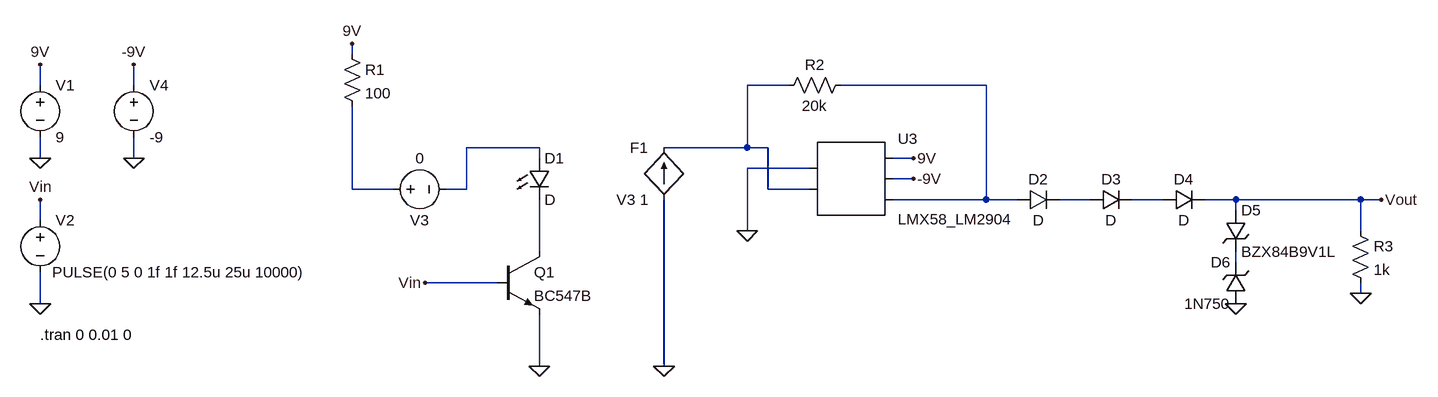
[diagram p0: schematic revolusys-communication.asc]
revolusys-communication.asc, the LTspice schematic file:
Version 4
SHEET 1 1832 680
WIRE 176 -272 176 -288
WIRE -304 -224 -304 -256
WIRE -160 -224 -160 -256
WIRE 848 -224 784 -224
WIRE 1152 -224 928 -224
WIRE 464 -128 352 -128
WIRE 784 -128 784 -224
WIRE 784 -128 656 -128
WIRE 816 -128 784 -128
WIRE -304 -112 -304 -144
WIRE -160 -112 -160 -144
WIRE 464 -112 464 -128
WIRE 1040 -112 1008 -112
WIRE 880 -96 784 -96
WIRE 1040 -80 1008 -80
WIRE 176 -64 176 -192
WIRE 240 -64 176 -64
WIRE 352 -64 352 -128
WIRE 352 -64 320 -64
WIRE 816 -64 816 -128
WIRE 880 -64 816 -64
WIRE 1152 -48 1152 -224
WIRE 1152 -48 1008 -48
WIRE 1200 -48 1152 -48
WIRE 1312 -48 1264 -48
WIRE 1424 -48 1376 -48
WIRE 1536 -48 1488 -48
WIRE 1728 -48 1536 -48
WIRE 1760 -48 1728 -48
WIRE 1536 -32 1536 -48
WIRE -304 -16 -304 -48
WIRE 784 0 784 -96
WIRE 1728 0 1728 -48
WIRE 464 32 464 -48
WIRE 1536 48 1536 32
WIRE 400 80 288 80
WIRE 1728 96 1728 80
WIRE -304 112 -304 64
WIRE 464 208 464 128
WIRE 656 208 656 -48
FLAG 464 208 0
FLAG -304 -112 0
FLAG -304 112 0
FLAG 656 208 0
FLAG 784 0 0
FLAG -304 -256 9V
FLAG 1040 -112 9V
FLAG 1728 96 0
FLAG -160 -112 0
FLAG 1536 112 0
FLAG -160 -256 -9V
FLAG 1040 -80 -9V
FLAG 176 -288 9V
FLAG -304 -48 Vin
FLAG 288 80 Vin
FLAG 1760 -48 Vout
SYMBOL npn 400 32 R0
SYMATTR InstName Q1
SYMATTR Value BC547B
SYMBOL res 160 -288 R0
SYMATTR InstName R1
SYMATTR Value 100
SYMBOL voltage -304 -240 R0
WINDOW 123 0 0 Left 2
WINDOW 39 0 0 Left 2
SYMATTR InstName V1
SYMATTR Value 9
SYMBOL voltage -304 -32 R0
WINDOW 123 0 0 Left 2
WINDOW 39 24 124 Left 2
WINDOW 3 18 96 Left 2
SYMATTR InstName V2
SYMATTR Value PULSE(0 5 0 1f 1f 12.5u 25u 10000)
SYMBOL res 944 -240 R90
WINDOW 0 0 56 VBottom 2
WINDOW 3 32 56 VTop 2
SYMATTR InstName R2
SYMATTR Value 20k
SYMBOL AutoGenerated\\LMX58_LM2904 944 -80 R0
SYMATTR InstName U3
SYMBOL LED 448 -112 R0
SYMATTR InstName D1
SYMBOL voltage 224 -64 R270
WINDOW 0 -32 56 VBottom 2
WINDOW 3 32 56 VTop 2
WINDOW 123 0 0 Left 2
WINDOW 39 0 0 Left 2
SYMATTR InstName V3
SYMATTR Value 0
SYMBOL f 656 -48 R180
WINDOW 0 24 80 Left 2
WINDOW 3 24 0 Left 2
SYMATTR InstName F1
SYMATTR Value V3 1
SYMBOL diode 1200 -32 R270
WINDOW 0 32 32 VTop 2
WINDOW 3 0 32 VBottom 2
SYMATTR InstName D2
SYMBOL diode 1312 -32 R270
WINDOW 0 32 32 VTop 2
WINDOW 3 0 32 VBottom 2
SYMATTR InstName D3
SYMBOL diode 1424 -32 R270
WINDOW 0 32 32 VTop 2
WINDOW 3 0 32 VBottom 2
SYMATTR InstName D4
SYMBOL res 1712 -16 R0
SYMATTR InstName R3
SYMATTR Value 1k
SYMBOL voltage -160 -240 R0
WINDOW 123 0 0 Left 2
WINDOW 39 0 0 Left 2
SYMATTR InstName V4
SYMATTR Value -9
SYMBOL zener 1520 -32 R0
SYMATTR InstName D5
SYMATTR Value BZX84B9V1L
SYMATTR Description Diode
SYMATTR Type diode
SYMBOL zener 1552 112 R180
WINDOW 0 24 64 Left 2
WINDOW 3 24 0 Left 2
SYMATTR InstName D6
SYMATTR Value 1N750
SYMATTR Description Diode
SYMATTR Type diode
TEXT -304 160 Left 2 !.tran 0 0.01 0

The netlist it stands for:
* revolusys-communication.asc
Q1 N007 Vin 0 0 BC547B
R1 9V N004 100
V1 9V 0 9
V2 Vin 0 PULSE(0 5 0 1f 1f 12.5u 25u 10000)
R2 N002 N001 20k
* U3: LMX58_LM2904 (symbol AutoGenerated\LMX58_LM2904 not available, pins judged from their places): pin1=0 pin2=N001 pin3=9V pin4=-9V pin5=N002
D1 N003 N007 D
V3 N004 N003 0
F1 0 N001 V3 1
D2 N002 N005 D
D3 N005 N006 D
D4 N006 Vout D
R3 Vout 0 1k
V4 -9V 0 -9
D5 Vout N008 BZX84B9V1L
D6 0 N008 1N750
.model D D
.lib standard.dio
.model NPN NPN
.model PNP PNP
.lib standard.bjt
.tran 0 0.01 0
.backanno
.end